# EAGLE design Radio_PIZero (EAGLE 7.6.0)
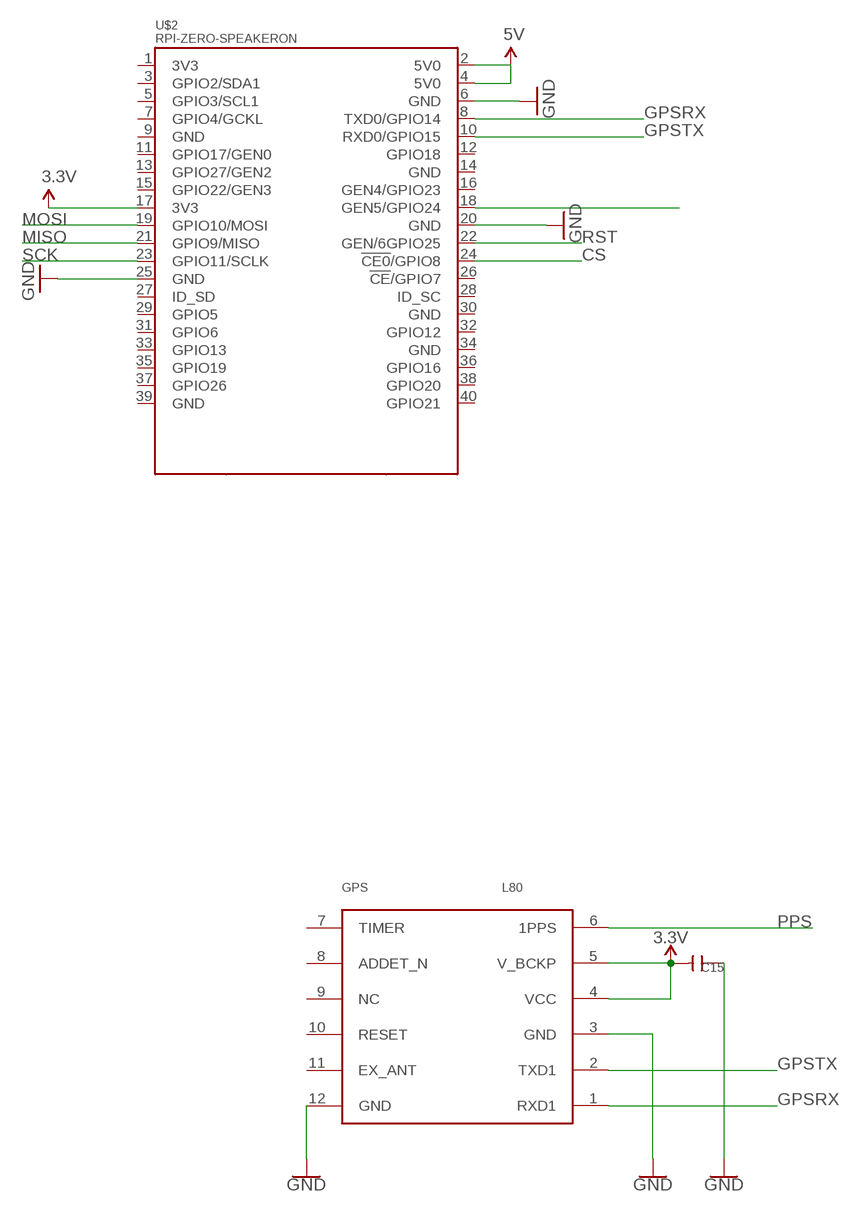
[diagram p0: schematic, sheet 1, part 1 of 2]
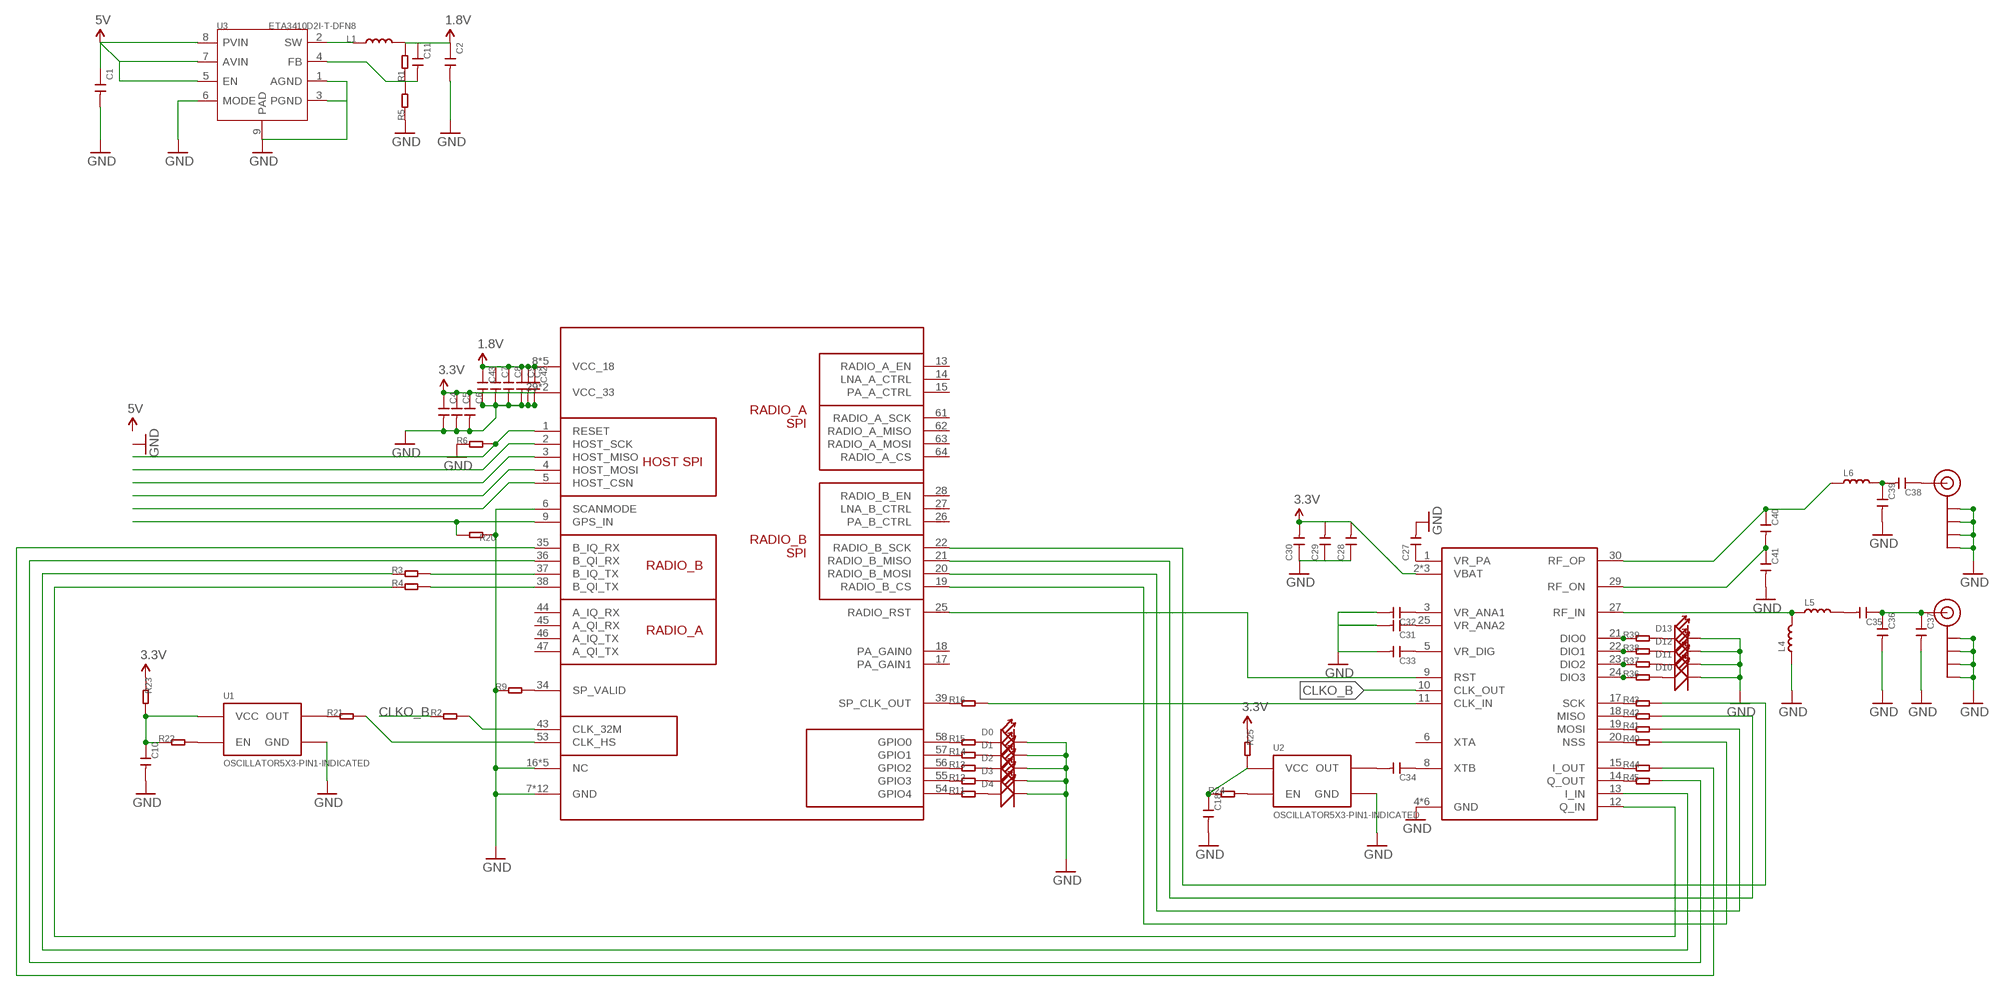
[diagram p1: schematic, sheet 1, part 2 of 2]

## Parts
C1  CAP-0603  [C0603@1]
C2  CAP-0805  [C0805@1]
C3  CAP-0402  [C0402@1]
C4  CAP-0402  [C0402@1]
C5  CAP-0603  [C0603@1]
C6  CAP-0402  [C0402@1]
C7  CAP-0402  [C0402@1]
C8  CAP-0402  [C0402@1]
C9  CAP-0402  [C0402@1]
C10  CAP-0402  [C0402@1]
C11  CAP-0402  [C0402@1]
C15  C-0603  [C0603]
C18  CAP-0402  [C0402@1]
C27  CAP-0402  [C0402@1]
C28  CAP-0402  [C0402@1]
C29  CAP-0402  [C0402@1]
C30  CAP-0402  [C0402@1]
C31  CAP-0402  [C0402@1]
C32  CAP-0402  [C0402@1]
C33  CAP-0402  [C0402@1]
C34  CAP-0402  [C0402@1]
C35  CAP-0402  [C0402@1]
C36  CAP-0402  [C0402@1]
C37  CAP-0402  [C0402@1]
C38  CAP-0402  [C0402@1]
C39  CAP-0402  [C0402@1]
C40  CAP-0402  [C0402@1]
C41  CAP-0402  [C0402@1]
C42  CAP-0402  [C0402@1]
C43  CAP-0402  [C0402@1]
D0  LED-0603  [LED-0603]
D1  LED-0603  [LED-0603]
D2  LED-0603  [LED-0603]
D3  LED-0603  [LED-0603]
D4  LED-0603  [LED-0603]
D10  LED-0402  [LED-0402]
D11  LED-0402  [LED-0402]
D12  LED-0402  [LED-0402]
D13  LED-0402  [LED-0402]
GPS  L80  [L80]
J$3  SMA_EDGE  [SMA-EDGE]
J$4  SMA_EDGE  [SMA-EDGE]
L1  L'1616BZ'  [1616BZ]
L4  INDUCTOR/FERRITE-BEAD-0402  [L0402@1]
L5  INDUCTOR/FERRITE-BEAD-0402  [L0402@1]
L6  INDUCTOR/FERRITE-BEAD-0402  [L0402@1]
R1  R-0402  [R0402]
R2  R-0402  [R0402]
R3  R-0402  [R0402]
R4  R-0402  [R0402]
R5  R-0402  [R0402]
R6  R-0402  [R0402]
R9  R-0402  [R0402]
R11  R-0402  [R0402]
R12  R-0402  [R0402]
R13  R-0402  [R0402]
R14  R-0402  [R0402]
R15  R-0402  [R0402]
R16  R-0402  [R0402]
R20  R-0402  [R0402]
R21  R-0402  [R0402]
R22  R-0402  [R0402]
R23  R-0402  [R0402]
R24  R-0402  [R0402]
R25  R-0402  [R0402]
R36  R-0402  [R0402]
R37  R-0402  [R0402]
R38  R-0402  [R0402]
R39  R-0402  [R0402]
R40  R-0402  [R0402]
R41  R-0402  [R0402]
R42  R-0402  [R0402]
R43  R-0402  [R0402]
R44  R-0402  [R0402]
R45  R-0402  [R0402]
U1  OSCILLATOR5X3-PIN1-INDICATED  [CRYSTAL-OSC-SMD-5X3]
U2  OSCILLATOR5X3-PIN1-INDICATED  [CRYSTAL-OSC-SMD-5X3]
U3  ETA3410D2I-T-DFN8  PMIC-ETA3410D2I-T(DFN8-2X2)  [DFN8G-0.5-2X2MM]
U$1  SX1301  [QFN64G-0.5-9X9MM]
U$2  RPI-ZERO-SPEAKERON  [RASPBERRYPI_BASTELSTUBE_V13_RASPI_BOARD_B+_FULL]
U$3  SX1255  [QFN32G-0.5-5X5MM]

## Nets
1.8V: C2.1 C3.1 C7.1 C8.1 C9.1 C11.1 C42.1 C43.1 L1.2 R1.2 U$1.8(VCC_18) U$1.12(VCC_18) U$1.23(VCC_18) U$1.42(VCC_18) U$1.60(VCC_18)
3.3V: C4.1 C5.1 C6.1 C15.2 C28.2 C29.2 C30.2 GPS.4(VCC) GPS.5(V_BCKP) R23.1 R25.1 U$1.29(VCC_33) U$1.52(VCC_33) U$2.17(3V3) U$3.2(VBAT) U$3.16(VBAT) U$3.32(VBAT)
5V: C1.1 U3.5(EN) U3.7(AVIN) U3.8(PVIN) U$2.2(5V0) U$2.4(5V0)
CLKO_B: R2.1 U$3.10(CLK_OUT)
CS: U$1.5(HOST_CSN) U$2.24(!CE0!/GPIO8)
GND: C1.2 C2.2 C3.2 C4.2 C5.2 C6.2 C7.2 C8.2 C9.2 C10.2 C15.1 C18.2 C27.2 C28.1 C29.1 C30.1 C31.2 C32.2 C33.2 C36.2 C37.2 C39.2 C41.2 C42.2 C43.2 D0.- D1.- D2.- D3.- D4.- D10.- D11.- D12.- D13.- GPS.3(GND) GPS.12(GND) J$3.GND@0(GND) J$3.GND@1(GND) J$3.GND@2(GND) J$3.GND@3(GND) J$4.GND@0(GND) J$4.GND@1(GND) J$4.GND@2(GND) J$4.GND@3(GND) L4.1 R5.1 R6.1 R9.1 R20.1 U1.2(GND) U2.2(GND) U3.1(AGND) U3.3(PGND) U3.6(MODE) U3.9(PAD) U$1.6(SCANMODE) U$1.7(GND) U$1.10(GND) U$1.11(GND) U$1.16(NC) U$1.24(GND) U$1.30(GND) U$1.31(GND) U$1.32(NC) U$1.33(NC) U$1.40(GND) U$1.41(GND) U$1.48(NC) U$1.49(NC) U$1.50(GND) U$1.51(GND) U$1.59(GND) U$1.65(GND) U$2.20(GND) U$2.25(GND) U$3.4(GND) U$3.7(GND) U$3.26(GND) U$3.28(GND) U$3.31(GND) U$3.33(GND)
GND@8: U$2.6(GND) ; supply symbol labelled GND
GPSRX: GPS.1(RXD1) U$2.8(TXD0/GPIO14)
GPSTX: GPS.2(TXD1) U$2.10(RXD0/GPIO15)
MISO: U$1.3(HOST_MISO) U$2.21(GPIO9/MISO)
MOSI: U$1.4(HOST_MOSI) U$2.19(GPIO10/MOSI)
N$1: L1.1 U3.2(SW)
N$2: R45.2 U$1.36(B_QI_RX)
N$3: R3.2 U$1.37(B_IQ_TX)
N$4: R4.2 U$1.38(B_QI_TX)
N$6: C11.2 R1.1 R5.2 U3.4(FB)
N$9: R9.2 U$1.34(SP_VALID)
N$11: R2.2 U$1.43(CLK_32M)
N$12: R11.1 U$1.54(GPIO4)
N$13: R12.1 U$1.55(GPIO3)
N$14: R13.1 U$1.56(GPIO2)
N$15: R14.1 U$1.57(GPIO1)
N$16: R15.1 U$1.58(GPIO0)
N$17: D4.+ R11.2
N$18: D3.+ R12.2
N$19: D1.+ R14.2
N$20: D0.+ R15.2
N$21: D2.+ R13.2
N$22: R16.1 U$1.39(SP_CLK_OUT)
N$30: R21.2 U$1.53(CLK_HS)
N$31: R21.1 U1.3(OUT)
N$32: R22.2 U1.1(EN)
N$33: C10.1 R22.1 R23.2 U1.4(VCC)
N$34: R24.2 U2.1(EN)
N$36: C18.1 R24.1 R25.2 U2.4(VCC)
N$37: C34.2 U2.3(OUT)
N$58: C27.1 U$3.1(VR_PA)
N$59: C31.1 U$3.25(VR_ANA2)
N$60: C32.1 U$3.3(VR_ANA1)
N$61: C33.1 U$3.5(VR_DIG)
N$62: C34.1 U$3.8(XTB)
N$63: R36.1 U$3.24(DIO3)
N$64: R37.1 U$3.23(DIO2)
N$65: R38.1 U$3.22(DIO1)
N$66: R39.1 U$3.21(DIO0)
N$67: D10.+ R36.2
N$68: D12.+ R38.2
N$69: D13.+ R39.2
N$70: D11.+ R37.2
N$71: L4.2 L5.1 U$3.27(RF_IN)
N$72: C35.2 L5.2
N$73: C35.1 C36.1 C37.1 J$3.SIG(SIGNAL)
N$74: C38.2 C39.1 L6.2
N$75: C40.1 L6.1 U$3.30(RF_OP)
N$76: C40.2 C41.1 U$3.29(RF_ON)
N$77: C38.1 J$4.SIG(SIGNAL)
N$78: R44.1 U$3.15(I_OUT)
N$79: R45.1 U$3.14(Q_OUT)
N$84: R43.2 U$1.22(RADIO_B_SCK)
N$85: R42.2 U$1.21(RADIO_B_MISO)
N$86: R41.2 U$1.20(RADIO_B_MOSI)
N$87: R40.2 U$1.19(RADIO_B_CS)
N$88: U$1.25(RADIO_RST) U$3.9(RST)
N$89: R16.2 U$3.11(CLK_IN)
N$90: R44.2 U$1.35(B_IQ_RX)
N$92: R3.1 U$3.13(I_IN)
N$93: R4.1 U$3.12(Q_IN)
N$103: R40.1 U$3.20(NSS)
N$104: R41.1 U$3.19(MOSI)
N$105: R42.1 U$3.18(MISO)
N$106: R43.1 U$3.17(SCK)
PPS: GPS.6(1PPS) R20.2 U$1.9(GPS_IN) U$2.18(GEN5/GPIO24)
RST: R6.2 U$1.1(RESET) U$2.22(GEN/6GPIO25)
SCK: U$1.2(HOST_SCK) U$2.23(GPIO11/SCLK)
Unconnected: GPS.7(TIMER) GPS.8(ADDET_N) GPS.9(NC) GPS.10(RESET) GPS.11(EX_ANT) U$1.13(RADIO_A_EN) U$1.14(LNA_A_CTRL) U$1.15(PA_A_CTRL) U$1.17(PA_GAIN1) U$1.18(PA_GAIN0) U$1.26(PA_B_CTRL) U$1.27(LNA_B_CTRL) U$1.28(RADIO_B_EN) U$1.44(A_IQ_RX) U$1.45(A_QI_RX) U$1.46(A_IQ_TX) U$1.47(A_QI_TX) U$1.61(RADIO_A_SCK) U$1.62(RADIO_A_MISO) U$1.63(RADIO_A_MOSI) U$1.64(RADIO_A_CS) U$2.1(3V3) U$2.3(GPIO2/SDA1) U$2.5(GPIO3/SCL1) U$2.7(GPIO4/GCKL) U$2.9(GND) U$2.11(GPIO17/GEN0) U$2.12(GPIO18) U$2.13(GPIO27/GEN2) U$2.14(GND) U$2.15(GPIO22/GEN3) U$2.16(GEN4/GPIO23) U$2.26(!CE!/GPIO7) U$2.27(ID_SD) U$2.28(ID_SC) U$2.29(GPIO5) U$2.30(GND) U$2.31(GPIO6) U$2.32(GPIO12) U$2.33(GPIO13) U$2.34(GND) U$2.35(GPIO19) U$2.36(GPIO16) U$2.37(GPIO26) U$2.38(GPIO20) U$2.39(GND) U$2.40(GPIO21) U$3.6(XTA)

## Library data of the parts
C1-C11 C18 C27-C43 = Discrete:CAP: Ceramic Capacitors
C15 = Discrete:C*: Ceramic Capacitors
D0 D1-D4 D10-D13 = Discrete:LED
GPS = L80:L80
J$3 J$4 = SparkFun-Connectors:SMA_EDGE: SMA Antenna Connector End launch SMA connector. The paste layer has been removed so that the connector can be hand soldered onto the board after reflow.
L1 = Discrete:L*
L4-L6 = Discrete:INDUCTOR/FERRITE-BEAD
R1-R6 R9 R11-R16 R20-R25 R36-R45 = Discrete:R*
U1 U2 = SparkFun-FreqCtrl:OSCILLATOR: Generic 5x3 and 7x5 oscillators
U3 = Seeed-IC:PMIC-ETA3410D2I-T(DFN8-2X2): 310030161; MPN: ETA3410D2I-T
U$1 = Seeed-OPL-ic:SX1301
U$2 = jos-ph:RPI-ZERO-SPEAKERON: Raspberry Pi Zero for SPEAKER ON
U$3 = Seeed-OPL-ic:SX1255

## Board
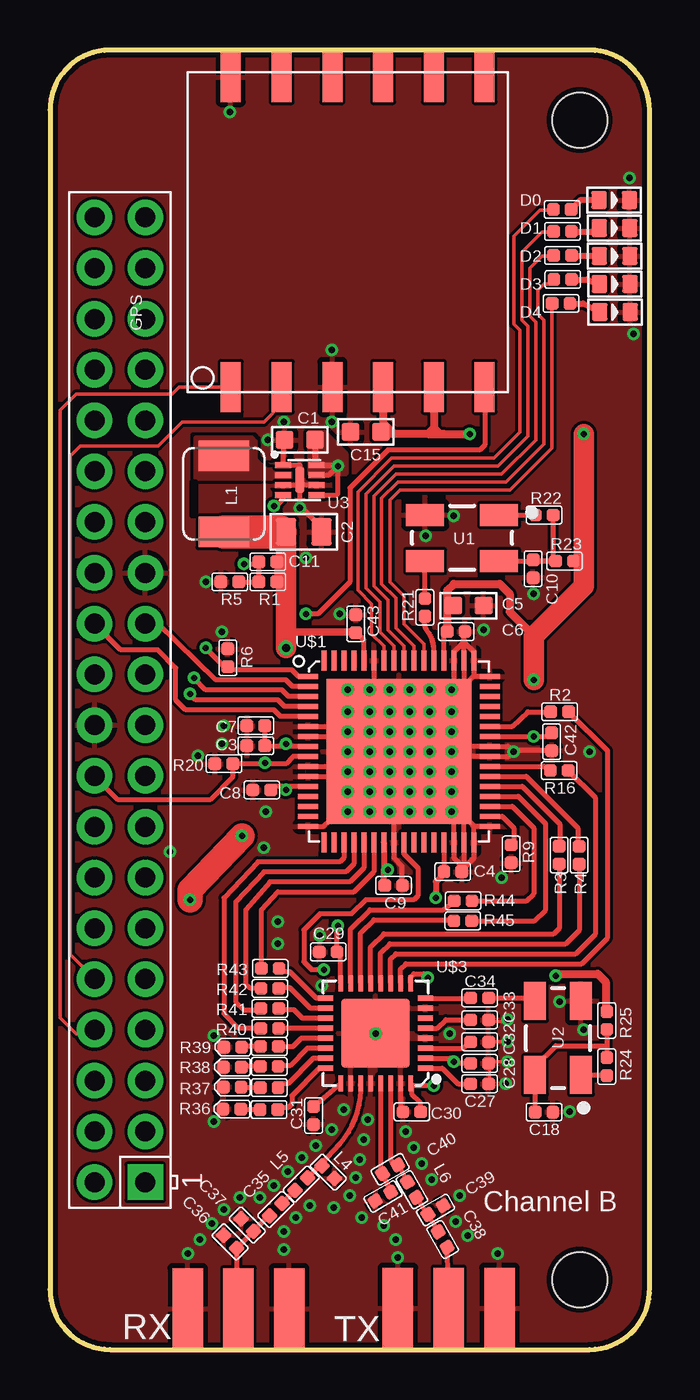
[diagram p2: board, top side]
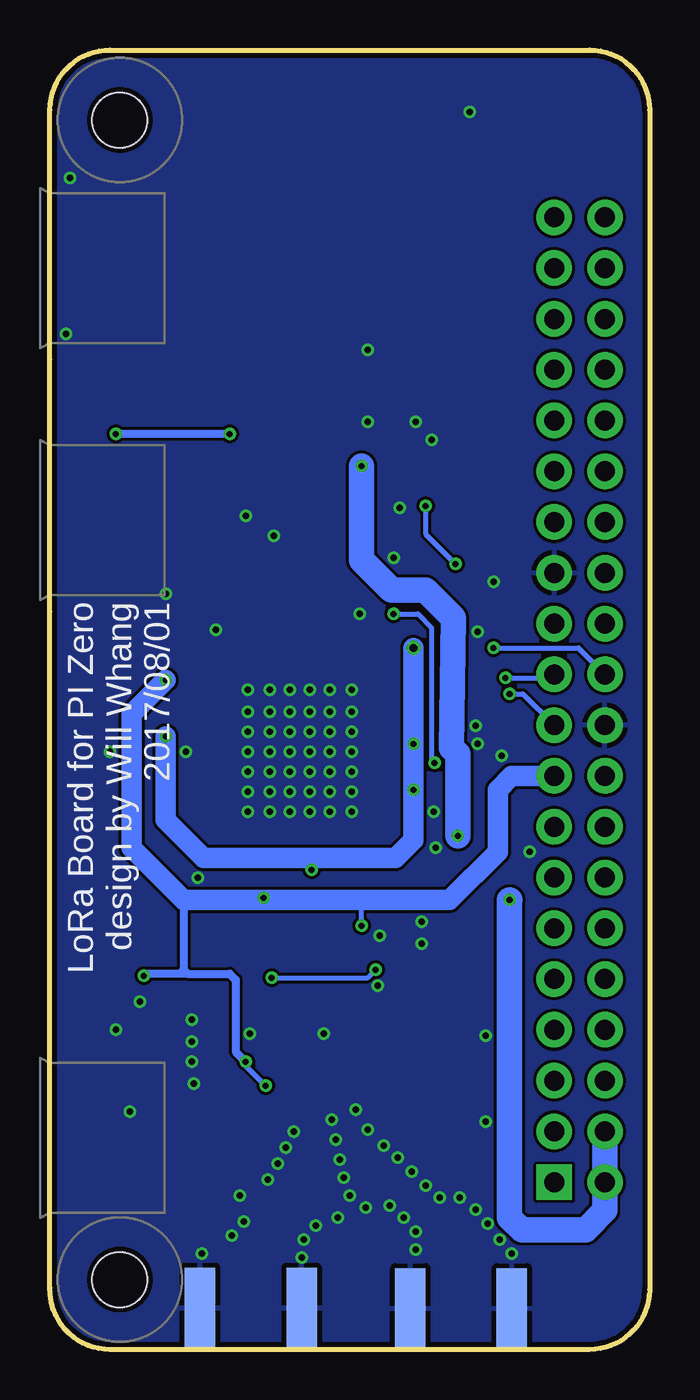
[diagram p3: board, bottom side, seen from below]

Size 30 x 65 mm. Coordinates in mm from the lower left corner, seen from the top.
Outline: 3,0 27,0 arc92 30,3.1 30,62 arc90 27,65 3,65 arc90 0,62 0,3 arc90 3,0
Copper layers (1*16): Top 0.035mm / dielectric 1.5mm / Bottom 0.035mm
Design rules "SeeedStudio_2layer_DRU_no_angle_20140221": minimum track width 6mil, minimum drill 12mil, track to track 6mil, track to pad 6mil, pad to pad 6mil, via to via 6mil, smd to smd 0mil, copper to edge 10mil, drill to drill 10mil, minimum pad ring 10mil, minimum via ring 6mil, stop-mask expansion 2mil, vias tented up to drill 100mil, thermal gap 10mil
tRestrict: area 20.5,33.7 to 20.9,34.8; area 21.4,29.7 to 22.5,30.1; area 20.5,24.9 to 20.9,26; area 12.9,28.7 to 14.2,29.1; area 7.1,41.7 to 7.3,43.4; area 12.8,30.7 to 14.1,31.1

### Footprints (pad centres in the part's own frame; a part is rotated, then mirrored left to right if it is on the bottom)
C0603@1 = smd 0.889 x 0.889: 1 -0.762,0; 2 0.762,0
C0805@1 = smd 1.016 x 1.397: 1 -0.889,0; 2 0.889,0
C0402@1 = smd 0.635 x 0.635: 1 -0.445,0; 2 0.445,0
C0603 = smd 0.889 x 0.889: 1 -0.762,0; 2 0.762,0
LED-0603 = smd 0.762 x 0.889: + -0.762,0; - 0.762,0
LED-0402 = smd 0.635 x 0.635: + -0.445,0; - 0.445,0
L80 = smd 2.5 x 1: 1 -7.75,5.85; 2 -7.75,3.31; 3 -7.75,0.77; 4 -7.75,-1.77; 5 -7.75,-4.31; 6 -7.75,-6.85; 7 7.75,-6.85; 8 7.75,-4.31; 9 7.75,-1.77; 10 7.75,0.77; 11 7.75,3.31; 12 7.75,5.85
SMA-EDGE = smd 1.524 x 4.064: GND@0 0,0; GND@1 5.08,0; SIG 2.54,0 | smd 1.524 x 4.064 bottom: GND@2 0,0; GND@3 5.08,0
1616BZ = smd 1.524 x 2.54: 1 -1.905,0; 2 1.905,0
L0402@1 = smd 0.635 x 0.635: 1 -0.445,0; 2 0.445,0
R0402 = smd 0.635 x 0.635: 1 -0.445,0; 2 0.445,0
CRYSTAL-OSC-SMD-5X3 = smd 1.9 x 1.1: 1 -1.85,-1.15; 2 1.85,-1.15; 3 1.85,1.15; 4 -1.85,1.15
DFN8G-0.5-2X2MM = smd 0.8 x 0.3: 1 -0.827,0.75; 2 -0.827,0.25; 3 -0.827,-0.25; 4 -0.827,-0.75; 5 0.827,-0.75; 6 0.827,-0.25; 7 0.827,0.25; 8 0.827,0.75 | smd 0.45 x 1.3: 9 0,0
QFN64G-0.5-9X9MM = smd 1 x 0.25: 1 -4.55,3.75; 2 -4.55,3.25; 3 -4.55,2.75; 4 -4.55,2.25; 5 -4.55,1.75; 6 -4.55,1.25; 7 -4.55,0.75; 8 -4.55,0.25; 9 -4.55,-0.25; 10 -4.55,-0.75; 11 -4.55,-1.25; 12 -4.55,-1.75; 13 -4.55,-2.25; 14 -4.55,-2.75; 15 -4.55,-3.25; 16 -4.55,-3.75; 33 4.55,-3.75; 34 4.55,-3.25; 35 4.55,-2.75; 36 4.55,-2.25; 37 4.55,-1.75; 38 4.55,-1.25; 39 4.55,-0.75; 40 4.55,-0.25; 41 4.55,0.25; 42 4.55,0.75; 43 4.55,1.25; 44 4.55,1.75; 45 4.55,2.25; 46 4.55,2.75; 47 4.55,3.25; 48 4.55,3.75 | smd 0.25 x 1: 17 -3.75,-4.55; 18 -3.25,-4.55; 19 -2.75,-4.55; 20 -2.25,-4.55; 21 -1.75,-4.55; 22 -1.25,-4.55; 23 -0.75,-4.55; 24 -0.25,-4.55; 25 0.25,-4.55; 26 0.75,-4.55; 27 1.25,-4.55; 28 1.75,-4.55; 29 2.25,-4.55; 30 2.75,-4.55; 31 3.25,-4.55; 32 3.75,-4.55; 49 3.75,4.55; 50 3.25,4.55; 51 2.75,4.55; 52 2.25,4.55; 53 1.75,4.55; 54 1.25,4.55; 55 0.75,4.55; 56 0.25,4.55; 57 -0.25,4.55; 58 -0.75,4.55; 59 -1.25,4.55; 60 -1.75,4.55; 61 -2.25,4.55; 62 -2.75,4.55; 63 -3.25,4.55; 64 -3.75,4.55 | smd 7.25 x 7.25: 65 0,0
RASPBERRYPI_BASTELSTUBE_V13_RASPI_BOARD_B+_FULL = drill 1 pad 1.778 square: 1 8.37,25.23 | drill 1 pad 1.778: 2 8.37,27.77; 3 10.91,25.23; 4 10.91,27.77; 5 13.45,25.23; 6 13.45,27.77; 7 15.99,25.23; 8 15.99,27.77; 9 18.53,25.23; 10 18.53,27.77; 11 21.07,25.23; 12 21.07,27.77; 13 23.61,25.23; 14 23.61,27.77; 15 26.15,25.23; 16 26.15,27.77; 17 28.69,25.23; 18 28.69,27.77; 19 31.23,25.23; 20 31.23,27.77; 21 33.77,25.23; 22 33.77,27.77; 23 36.31,25.23; 24 36.31,27.77; 25 38.85,25.23; 26 38.85,27.77; 27 41.39,25.23; 28 41.39,27.77; 29 43.93,25.23; 30 43.93,27.77; 31 46.47,25.23; 32 46.47,27.77; 33 49.01,25.23; 34 49.01,27.77; 35 51.55,25.23; 36 51.55,27.77; 37 54.09,25.23; 38 54.09,27.77; 39 56.63,25.23; 40 56.63,27.77 | hole 2.75: 3.5,3.5; 61.5,3.5
QFN32G-0.5-5X5MM = smd 0.813 x 0.279: 1 -2.5,1.75; 2 -2.5,1.25; 3 -2.5,0.75; 4 -2.5,0.25; 5 -2.5,-0.25; 6 -2.5,-0.75; 7 -2.5,-1.25; 8 -2.5,-1.75; 17 2.5,-1.75; 18 2.5,-1.25; 19 2.5,-0.75; 20 2.5,-0.25; 21 2.5,0.25; 22 2.5,0.75; 23 2.5,1.25; 24 2.5,1.75 | smd 0.279 x 0.813: 9 -1.75,-2.5; 10 -1.25,-2.5; 11 -0.75,-2.5; 12 -0.25,-2.5; 13 0.25,-2.5; 14 0.75,-2.5; 15 1.25,-2.5; 16 1.75,-2.5; 25 1.75,2.5; 26 1.25,2.5; 27 0.75,2.5; 28 0.25,2.5; 29 -0.25,2.5; 30 -0.75,2.5; 31 -1.25,2.5; 32 -1.75,2.5 | smd 3.429 x 3.429: 33 0,0

### Placement (x,y rotation side)
C1  12.5,45.5 180 top
C2  12.7,40.9 0 top
C3  10.3,31.2 180 top
C4  20.16,23.9 0 top
C5  20.93,37.21 0 top
C6  20.32,35.91 0 top
C7  10.3,30.2 180 top
C8  10.6,27.99 180 top
C9  17.19,23.21 0 top
C10  24.17,39.05 270 top
C11  10.9,39.4 180 top
C15  15.8,45.9 0 top
C18  24.72,11.88 0 top
C27  21.5,13.29 0 top
C28  21.5,14.31 180 top
C29  13.92,19.89 0 top
C30  18.11,11.89 0 top
C31  13.19,11.7 270 top
C32  21.5,15.39 0 top
C33  21.5,16.49 0 top
C34  21.5,17.59 0 top
C35  11.3,7.01 45 top
C36  9.01,5.39 135 top
C37  9.87,6.23 135 top
C38  19.65,5.5 120 top
C39  19.29,6.98 30 top
C40  17.02,9.02 210 top
C41  16.66,7.66 210 top
C42  25.1,30.4 270 top
C43  15.3,36.3 90 top
D0  28.23,57.49 0 top
D1  28.24,56.09 0 top
D2  28.25,54.69 0 top
D3  28.26,53.29 0 top
D4  28.27,51.89 0 top
D10  9.11,12.03 180 top
D11  9.12,13.13 180 top
D12  9.13,14.13 180 top
D13  9.14,15.13 180 top
GPS  14.9,55.9 90 top
J$3  11.97,2.04 180 top
J$4  17.41,2.06 0 top
L1  8.7,42.8 270 top
L4  13.93,8.87 135 top
L5  12.57,8.28 225 top
L6  18.11,7.99 300 top
R1  10.9,38.4 0 top
R2  25.5,31.9 180 top
R3  25.48,24.73 90 top
R4  26.48,24.72 90 top
R5  9,38.4 0 top
R6  8.9,34.6 270 top
R9  23.08,24.79 90 top
R11  25.57,52.32 0 top
R12  25.66,53.52 0 top
R13  25.65,54.72 0 top
R14  25.64,55.92 0 top
R15  25.63,57.02 0 top
R16  25.48,28.96 0 top
R20  8.7,29.3 0 top
R21  18.76,37.12 270 top
R22  24.73,41.74 180 top
R23  25.74,39.44 180 top
R24  27.86,14.15 270 top
R25  27.86,16.46 270 top
R36  10.96,12 180 top
R37  10.97,13.1 180 top
R38  10.97,14.16 180 top
R39  10.98,15.16 180 top
R40  10.99,16.06 180 top
R41  11,17.06 180 top
R42  11.01,18.06 180 top
R43  11.02,19.06 180 top
R44  20.67,22.44 0 top
R45  20.66,21.44 0 top
U1  20.62,40.59 180 top
U2  25.42,15.58 90 top
U3  12.5,43.5 0 top
U$1  17.45,29.92 0 top
U$2  30,0 90 top
U$3  16.29,15.82 180 top

### Tracks (layer width: path | path; a pad name or v marks a point on that pad's centre or on a via)
1.8V  (via drill 0.3, 0.4)
  Top 0.254: U$1.42 v24.2,30.67 24.93,30.67 C42.1 | 10.9,28 10.99,27.99 C8.1 11.16,28.17 11.73,28.17 | 16.7,23.2 16.75,23.05 C9.1 | U$1.8 11.93,30.17 v11.8,30.3 11.8,30.2 C7.1 C3.1 | U$1.12 11.73,28.17 | 11.73,28.17 v11.8,28 | U$1.60 15.7,35.5 15.4,35.8 C43.1 | C11.1 R1.2 11.61,38.4 11.81,38.2
  Top 0.305: U$1.23 16.7,24 | 16.7,23.2 16.7,24 | 16.7,24 v16.9,24
  Top 0.406: C43.1 12,35.9 11.8,35.7
  Top 0.813: C2.1 11.5,40.9
  Top 1.016: C2.1 11.81,38.2 11.81,37.81 11.8,35.7 v11.8,35.1
  Top 1.676: L1.2 11.09,40.9 11.5,40.9
  Bottom 0.305: v16.9,24 16.9,24.5 17,24.6
  Bottom 1.016: v11.8,35.1 v11.8,30.3 v11.8,28 11.8,25.5 12.7,24.6 17,24.6 22.3,24.6 24.2,26.5 v24.2,30.67
3.3V  (via drill 0.3)
  Top 0.254: U$1.52 19.7,35.83 C6.1 | U$1.29 19.7,23.82 C4.1 | U$3.16 14.54,19.71 C29.2 14.36,21.16 v14.4,21.2 | U$3.32 18.16,13.2 v19.2,13.2 18.1,13.2 18.1,12.8 18.5,12.4 18.5,11.95 C30.2 | C28.2 20.31,14.31 v20.2,14.4 20.03,14.57 U$3.2 | C5.1 20.17,37.09 19.88,36.8
  Top 0.305: 19.7,23.82 19.7,23.8 19.3,23.4 v19.3,22.6
  Top 0.406: C6.1 19.88,36.8 19.88,37.98 20.2,38.3 22.5,38.3 23,37.8 23,36.9 24.2,35.7 | R23.1 26.56,39.44 26.7,39.3 | GPS.4 16.67,45.81 | 16.67,45.81 C15.2 | GPS.5 19.21,45.91 19.11,45.81 | v25.3,18.7 25.4,18.8 27.4,18.8 27.8,18.4 27.8,16.96 R25.1 | 16.67,45.81 19.11,45.81 | 19.11,45.81 19.69,45.81 19.7,45.8 19.5,45.8 19.2,46.1 18.9,45.8 | 18.9,45.8 17.2,45.8 16.7,46.3 | 18.9,45.8 v21,45.8
  Top 1.016: v24.2,33.5 24.2,35.7 26.7,38.2 26.7,39.3 v26.7,45.8
  Bottom 0.254: v14.4,21.2 14.4,22.4 14.3,22.5 | v20.2,14.4 20.2,14.2 v19.2,13.2
  Bottom 0.305: v19.3,22.6 19.3,22.5
  Bottom 0.406: 23.3,22.5 23.3,19 | 23.1,18.8 23.5,18.8 | 23.3,19 23.5,18.8 | 23.5,18.8 25.2,18.8 v25.3,18.7 | 23.3,19 23.1,18.8 | 23.1,18.8 21,18.8 20.7,18.5 20.7,14.9 v20.2,14.4 | v21,45.8 v26.7,45.8
  Bottom 1.016: U$2.17 6.91,28.69 7.6,28 7.6,24.9 10,22.5 14.3,22.5 19.3,22.5 23.3,22.5 25.9,25.1 25.9,31.8 v24.2,33.5
5V  (via drill 0.3)
  Top 0.254: U3.5 14.35,42.75 14.4,42.8 v14.4,44.2 13.95,43.75 U3.7
  Top 0.305: v14.4,44.2 14.35,44.25 U3.8 13.26,44.32 C1.1
  Top 1.27: v7,22.5 7,23 v9.6,25.7
  Bottom 1.27: U$2.4 U$2.2 2.23,6.97 3.2,6 6.4,6 7,6.6 v7,22.5 | v9.6,25.7 9.6,29.8 9.9,30.1 9.8,36.6 11.2,38 12.9,38 14.4,39.5 v14.4,44.2
  pour Top (no thermals): 13,45.9 13.7,45.9 14.8,44.8 14.8,43.8 13,43.8
CLKO_B
  Top 0.254: U$3.10 17.54,19.04 17.8,19.3 26.6,19.3 27.9,20.6 27.9,29.95 R2.1
CS
  Top 0.254: U$1.5 11.53,31.67 11.2,32 6.8,32 6.3,32.5 6.3,34.1 5.4,35 3.54,35 U$2.24
GND  (via drill 0.33)
  Top 0.152: 20.2,34.3 U$1.51 | C27.2 22,13.4 22,14.15 C28.1 22,14.4 v22.9,14.4 | 22.95,24.3 R9.1 | C33.2 22,16.4 22.75,16.4 v22.9,16.5 | v22.9,15.4 22,15.4 C32.2 | 22.2,26.15 U$1.33 | U$3.33 16.1,15.65 v16.3,15.8 | U$1.65 19.05,29.65 19.05,29.9 v19,29.9 | 15.05,29.92 17.05,29.65 17.05,29.9 v17,29.9 | 14.95,29.52 14.95,29.9 v14.9,29.9
  Top 0.254: 20.7,35.88 C6.2 20.7,35.84 20.7,35.4 | v20.1,29.9 20.27,30.17 20.1,30.2 20.13,30.17 U$1.41 22.93,30.17 v23.2,29.9 | 18.37,30.17 v18,29.9 | 16.37,30.17 v16,29.9 | U$1.16 13.67,26.17 14,26.5 14.5,26.5 v14.9,26.9 | U$1.10 14.17,29.17 v14.9,29.9 | U$1.11 14.67,28.67 v14.9,28.9 | U$1.7 14.67,30.67 v14.9,30.9 14.9,31.17 U$1.6 | 20.7,24.1 20.7,23.9 C4.2 20.7,24 U$1.31 20.7,26.7 | 20.7,24.1 20.2,24.6 U$1.30 20.2,26.8 v20.1,26.9 | 20.7,24.1 21.2,24.6 U$1.32 21.2,26.2 | 20.8,26.6 21.2,26.2 | U$1.33 21.23,26.17 21.2,26.2 | 20.2,33 U$1.51 20.2,34.9 20.7,35.4 | U$1.50 20.7,35.4 | U$1.50 20.7,33.2 20.3,33.2 v20.1,33 | U$1.50 20.7,33.5 20.6,33.4 | 20.7,35.4 21.2,34.9 U$1.49 21.2,33.7 21.17,33.67 | U$1.48 21.17,33.67 | 21.17,33.67 20.8,33.3 | v23.2,29.9 22.97,29.67 U$1.40 17.7,29.67 U$1.65 17.2,29.77 U$1.24 17.2,24.6 17.6,24.2 17.6,23.25 C9.2 | C42.2 23.25,29.96 v23.2,29.9 | U$1.59 16.2,33.2 v16,33 | U$3.31 17.54,12.01 C30.1 | U3.3 12.5,43.25 | U3.6 12.5,43.25 | 12.5,43.25 U3.9 | U3.9 12.5,44.25 U3.1 11.67,45.5 C1.2 | C2.2 13.59,41.11 12.5,42.2 U3.9
  Top 0.305: C15.1 15.04,45.76 15.1,45.7
  other vias: 22.8,13.3 13.5,20.7 20,15.8 22.6,23.6 20.1,31.9 20.1,30.9 20.1,28.9 20.1,27.9 19,33 19,31.9 19,30.9 19,28.9 19,27.9 19,26.9 21.7,36 7.8,38.4 18,33 18,31.9 18,30.9 18,28.9 18,27.9 18,26.9 17,33 17,31.9 17,30.9 17,28.9 17,27.9 17,26.9 16,31.9 16,30.9 16,28.9 16,27.9 16,26.9 14.9,33 14.9,31.9 14.9,27.9 14.5,36.8 6,24.9 24.2,37.8 14.1,50 18.8,40.7 10.7,25.1 10.8,26.9 26,11.9 25.5,17.4 26.7,16 8.1,6.3 7.5,5.5 6.9,4.8 8.7,7 9.5,7.6 10.5,7.6 11.2,8.2 11.9,8.9 12.6,9.6 13.3,10.2 15.9,11.5 15.7,10.5 15.5,9.5 15.3,8.6 15,7.7 14.2,7.1 15.6,6.6 13,7.2 12.3,6.6 11.7,5.9 11.7,5 16.7,6.2 17.3,5.5 17.4,4.6 17.8,10.9 18.2,10.1 18.6,9.3 19.1,8.5 20.5,7.7 20.3,6.4 20.9,5.7 22.4,4.8 14.1,11 14.7,12 8.2,11.4 8.2,15.7 27,29.9 20.2,41.7 29.2,50.8 29,58.6 9,61.9 8.6,30.3 12.8,39.6 12.5,42.1 11.7,46.4 10.9,45.5 14.1,46.4 11.4,21.4 11.4,20.3 13.6,18.2 8.7,31.2 7.4,29.7 8.6,35.9
  pour Bottom: -2.2,66.6 34.4,66.6 34.4,-2.3 -2.3,-2.3 -2.3,66.6
  pour Top (rank 2): -2.4,65.7 33.8,65.7 33.8,-1.5 -2.4,-1.5
GPSRX
  Top 0.178: GPS.1 6.45,48.15 6.1,47.8 1.3,47.8 0.5,47 0.5,16.6 1.3,15.8 2.04,15.8 U$2.8
GPSTX
  Top 0.178: GPS.2 11.59,47.29 10.7,46.4 6.6,46.4 5.4,45.2 1.5,45.2 1,44.7 1,19.76 U$2.10
MISO  (via drill 0.3)
  Top 0.254: U$1.3 11.93,32.67 11.6,33 7.8,33 v7.2,33.6
  Bottom 0.254: v7.2,33.6 4.94,33.6 U$2.21
MOSI  (via drill 0.3)
  Top 0.254: U$1.4 11.73,32.17 11.4,32.5 7.3,32.5 v7,32.8
  Bottom 0.254: v7,32.8 6.34,32.8 U$2.19
N$1
  pour Top (no thermals): 12,44 10.8,44 10.3,44.5 10.3,45.4 10.1,45.6 7.3,45.6 7.3,43.6 12,43.6
N$2
  Top 0.254: U$1.36 23.43,27.67 24.8,26.3 24.8,22 24.24,21.44 R45.2
N$3
  Top 0.254: U$1.37 23.63,28.17 25.5,26.3 25.5,25.2 R3.2
N$4
  Top 0.254: U$1.38 23.83,28.67 26.4,26.1 26.4,25.25 R4.2
N$6  (via drill 0.3)
  Top 0.254: U3.4 11.65,42.55 11.3,42.2 v11.2,42.2 | v9.7,39.3 10.35,39.3 C11.2 R1.1 R5.2
  Bottom 0.254: v11.2,42.2 11.2,40.8 v9.7,39.3
N$9
  Top 0.254: U$1.34 22.63,26.67 23.2,26.1 23.2,25.36 R9.2
N$11
  Top 0.254: U$1.43 23.12,31.17 23.9,31.9 R2.2
N$12
  Top 0.178: U$1.54 18.7,35.3 17.7,36.3 17.7,37.7 17,38.4 17,42.5 17.5,43 23,43 25.1,45.1 25.1,52.29 R11.1
N$13
  Top 0.178: U$1.55 18.2,35.2 17.3,36.1 17.3,37.6 16.6,38.3 16.6,42.6 17.4,43.4 22.8,43.4 24.7,45.3 24.7,51.5 24.4,51.8 24.4,53 24.7,53.3 25,53.3 R12.1
N$14
  Top 0.178: U$1.56 17.7,35.2 16.9,36 16.9,37.5 16.2,38.2 16.2,42.7 17.3,43.8 22.6,43.8 24.3,45.5 24.3,51.4 24,51.7 24,54.1 24.6,54.7 25.18,54.7 R13.1
N$15
  Top 0.178: U$1.57 17.2,35.2 16.5,35.9 16.5,37.4 15.8,38.1 15.8,42.8 17.2,44.2 22.4,44.2 23.9,45.7 23.9,51.2 23.6,51.5 23.6,54.9 24.6,55.9 25.18,55.9 R14.1
N$16
  Top 0.178: U$1.58 16.7,35.2 16.1,35.8 16.1,37.3 15.4,38 15.4,42.9 17.1,44.6 22.2,44.6 23.5,45.9 23.5,51 23.2,51.3 23.2,55.7 24.5,57 25.16,57 R15.1
N$17
  Top 0.305: R11.2 26.68,52.32 D4.+
N$18
  Top 0.305: R12.2 26.87,53.52 D3.+
N$19
  Top 0.305: R14.2 27.31,55.92 D1.+
N$20
  Top 0.305: D0.+ 26.54,57.49 R15.2
N$21
  Top 0.305: R13.2 27.46,54.72 D2.+
N$22
  Top 0.254: 25.07,28.97 R16.1 24.93,28.8 25.1,28.8 24.73,29.17 U$1.39
N$30
  Top 0.254: U$1.53 19.2,35.1 arc37 18.9,35.9 arc-53 R21.2
N$31
  Top 0.254: R21.1 U1.3
N$32
  Top 0.254: U1.1 R22.2
N$33
  Top 0.254: U1.4 R23.2 | R22.1 25.17,39.56 R23.2 | R23.2 24.26,39.44 C10.1
N$34
  Top 0.254: U2.1 27.84,13.73 R24.2
N$36
  Top 0.254: R25.2 27.86,15.2 | 27.86,15.2 R24.1 | 27.86,15.2 25.3,15.2 24.27,14.17 U2.4 24.27,12.09 C18.1
N$37
  Top 0.254: C34.2 24.11,17.59 U2.3
N$58
  Top 0.254: U$3.1 19.63,14.07 20.4,13.3 21.05,13.3 C27.1
N$59
  Top 0.254: U$3.25 14.54,13.29 C31.1
N$60
  Top 0.254: U$3.3 20.67,15.07 21,15.4 21.05,15.4 C32.1
N$61
  Top 0.254: U$3.5 19.37,16.07 19.8,16.5 21.05,16.5 C33.1
N$62
  Top 0.254: U$3.8 21.04,17.57 C34.1
N$63
  Top 0.254: U$3.24 13.47,14.07 12.1,12.7 12.1,12.3 11.9,12.1 11.5,12.1 R36.1
N$64
  Top 0.254: U$3.23 13.17,14.57 11.9,13.3 11.61,13.3 R37.1
N$65
  Top 0.254: U$3.22 12.87,15.07 12,14.2 11.46,14.2 R38.1
N$66
  Top 0.254: R39.1 12.16,15.16 12.57,15.57 U$3.21
N$67
  Top 0.254: R36.2 9.58,12 D10.+
N$68
  Top 0.254: R38.2 9.6,14.16 D12.+
N$69
  Top 0.254: R39.2 9.61,15.16 D13.+
N$70
  Top 0.254: R37.2 9.59,13.1 D11.+
N$71
  Top 0.254: L5.1 13.58,9.29 | 13.58,9.29 L4.2 | 13.58,9.29 14.5,10.3 arc47 U$3.27
N$72
  Top 0.254: C35.2 L5.2
N$73
  Top 0.152: C37.1 10.11,5.84 10.1,5.85
  Top 0.254: 10.1,5.85 10.95,6.69 C35.1 | C37.1 C36.1 9.33,2.14 J$3.SIG
N$74
  Top 0.254: L6.2 18.86,6.77 | 18.86,6.77 C38.2 | C39.1 18.88,6.76 18.86,6.77
N$75
  Top 0.254: L6.1 C40.1 arc-90 17.04,9.61 U$3.30
N$76
  Top 0.254: U$3.29 16.54,8.89 arc90 C40.2 C41.1
N$77
  Top 0.254: C38.1 19.91,2.06 J$4.SIG
N$78
  Top 0.254: U$3.15 15.04,21.04 16,22 19.68,22 R44.1
N$79
  Top 0.254: U$3.14 15.54,20.84 16.2,21.5 20.05,21.5 R45.1
N$84
  Top 0.254: R43.2 10.58,21.98 11.4,22.9 15.2,22.9 16.2,23.9 U$1.22
N$85
  Top 0.254: U$1.21 15.7,24.1 15,23.4 11,23.4 9.8,22 9.8,18.3 10,18.1 10.52,18.1 R42.2
N$86
  Top 0.254: U$1.20 15.2,24.3 14.8,23.9 10.7,23.9 9.3,22.4 9.3,17.4 9.7,17 10.5,17 R41.2
N$87
  Top 0.254: U$1.19 14.7,24.6 14.5,24.4 10.4,24.4 8.7,22.6 8.7,16.8 9.4,16.1 10.51,16.1 R40.2
N$88  (via drill 0.3)
  Top 0.254: U$1.25 17.7,24.8 18.4,24.1 18.4,22.7 18.2,22.5 15.8,22.5 15.1,21.8 13.5,21.8 12.7,21 12.7,19.4 13.1,19 v13.7,19 | U$3.9 18.04,18.64 18.2,18.8 18.7,18.8 v18.9,18.6
  Bottom 0.254: v18.9,18.6 14.1,18.6 v13.7,19
N$89
  Top 0.254: U$3.11 17.04,19.54 17.3,19.8 26.3,19.8 27.3,20.8 27.3,27.59 R16.2
N$90
  Top 0.254: U$1.35 23.13,27.17 24.2,26.1 24.2,22.8 23.84,22.44 R44.2
N$92
  Top 0.254: U$3.13 16.04,20.14 16.7,20.8 25.2,20.8 25.5,21.1 25.5,24.27 R3.1
N$93
  Top 0.254: U$3.12 16.54,19.84 17,20.3 25.8,20.3 26.5,21 26.5,24.26 R4.1
N$103
  Top 0.254: U$3.20 11.44,16.07 R40.1
N$104
  Top 0.254: U$3.19 12.63,16.57 12.2,17 11.5,17 R41.1
N$105
  Top 0.254: U$3.18 13.03,17.07 12,18.1 11.49,18.1 R42.1
N$106
  Top 0.254: U$3.17 13.33,17.57 12,18.9 11.62,18.9 R43.1
PPS  (via drill 0.3)
  Top 0.254: 10.8,29.3 R20.2 9.14,28.64 8,27.5 3.42,27.5 U$2.18 | GPS.6 21.75,45.25 21.5,45 16.9,45 15,43.1 15,38.4 13.4,36.8 v12.8,36.8 | U$1.9 12.17,29.67 11.8,29.3 10.8,29.3 | 10.8,29.3 v10.75,29.35
  Bottom 0.254: v12.8,36.8 11.6,36.8 10.9,36.1 10.9,29.6 v10.75,29.35
RST  (via drill 0.3)
  Top 0.254: U$1.1 12.43,33.67 12.1,34 8.9,34 8.8,34.1 | 8.8,34.1 v7.8,35.1 | R6.2 8.85,34.16 8.8,34.1
  Bottom 0.254: v7.8,35.1 3.56,35.1 U$2.22
SCK
  Top 0.254: U$1.2 12.13,33.17 11.8,33.5 8.3,33.5 5.39,36.31 U$2.23

### Text on the board
tPlace: Channel B | RX | TX
bNames: LoRa Board for PI Zero / design by Will Whang / 2017/08/01